# Altium schematic sheet Fuel Gauge.SchDoc
size A4; PageSetup: Record=PageOptions|CenterHorizontal=True|CenterVertical=True|PrintScale=0.97|XCorrection=1.00|YCorrection=1.00|PrintKind=2|BorderSize=5000000|LeftOffset=0|BottomOffset=0|Orientation=2|PaperLength=1000|PaperWidth=1000|Scale=100|PaperSource=7|PrintQuality=-3|MediaType=1|DitherType=10|PrintScaleMode=1|PaperKind=A4|PaperIndex=9
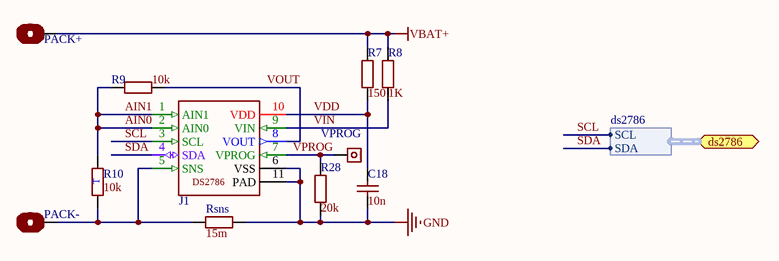
[diagram p0: Fuel Gauge.SchDoc]

## Parts
C18  value 10n  [C0402_h]  (hidden comment: Capacitor)
J1  DS2786G+  [TDFN-EP-10]  (value not drawn)
PACK+  Pad  [PAD]  (value not drawn)
PACK-  Pad  [PAD]  (value not drawn)
R7  value 150  [R0402]  (hidden comment: Register)
R8  value 1K  [R0402]  (hidden comment: Register)
R9  value 10k  [R0402]  (hidden comment: Register)
R10  value 10k  [NTC]  (hidden comment: Register)
R28  value 20k  [R0402]  (hidden comment: Register)
Rsns  value 15m  [R0805]  (hidden comment: Register)
VPROG  TestPoint  [TestPoint]  (value not drawn)

## Ports
ds2786 (harness ds2786)

## Harnesses
ds2786: SCL, SDA

## Nets
GND: C18.1 J1.6(VSS) J1.11(PAD) R28.2 Rsns.2
VBAT+: PACK+.1 R7.1 R8.1
AIN0: J1.1(AIN1) J1.2(AIN0) R9.2 R10.2  [also labelled AIN1]
SCL: J1.3(SCL) ; port ds2786.SCL
SDA: J1.4(SDA) ; port ds2786.SDA
VDD: C18.2 J1.10(VDD) R7.2
VIN: J1.9(VIN) R8.2
VOUT: J1.8(VOUT) R9.1
VPROG: J1.7(VPROG) R28.1 VPROG.1(test)
NetJ1_5: J1.5(SNS) PACK-.1 R10.1 Rsns.1

## Notes on the sheet
- (in symbol DS2786G+) DS2786
- (in symbol TestPoint) testpoint
- (in symbol 热敏电阻) T

## Library data of the parts
C18 = 贴片电容-无极性: VDC: 10V; Published: 8-Jun-2000; LatestRevisionDate: 17-Jul-2002; LatestRevisionNote: Re-released for DXP Platform.; PackageReference: RAD-0.3; Publisher: Altium Limited; PackageDescription: Radial Cap, Thru-Hole; 2 Leads; 0.3 in Pin Spacing
J1 = DS2786G+: Fuek Gauge; Voltage - Supply: 2.5 V ~ 5.5 V; Battery Type: Li-Ion, Li-Pol; Function: Fuel, Gas Gauge/Monitor; Vendor: Maxim Integrated Products; Battery Chemistry: Lithium-Ion (Li-Ion), Lithium-Polymer (Li-Pol); Packaging: Tube; Package / Case: 10-WFDFN Exposed Pad; Operating Temperature: -40??C ~ 85??C; DataSheet: http://datasheets.maxim-ic.com/en/ds/DS2786.pdf; DigiKeyPartNumber: DS2786G+-ND; Manufacturer_Part_Number: DS2786G+; Quantity_Available: 928; Mounting Type: Surface Mount; Supplier Device Package: 10-TDFN-EP (3x4); RefDes: RefDes; Type: DEV; Value: Value
R7-R9 R28 Rsns = 贴片电阻
R10 = 热敏电阻